# Altium project WiFi智能家居.PrjPCB
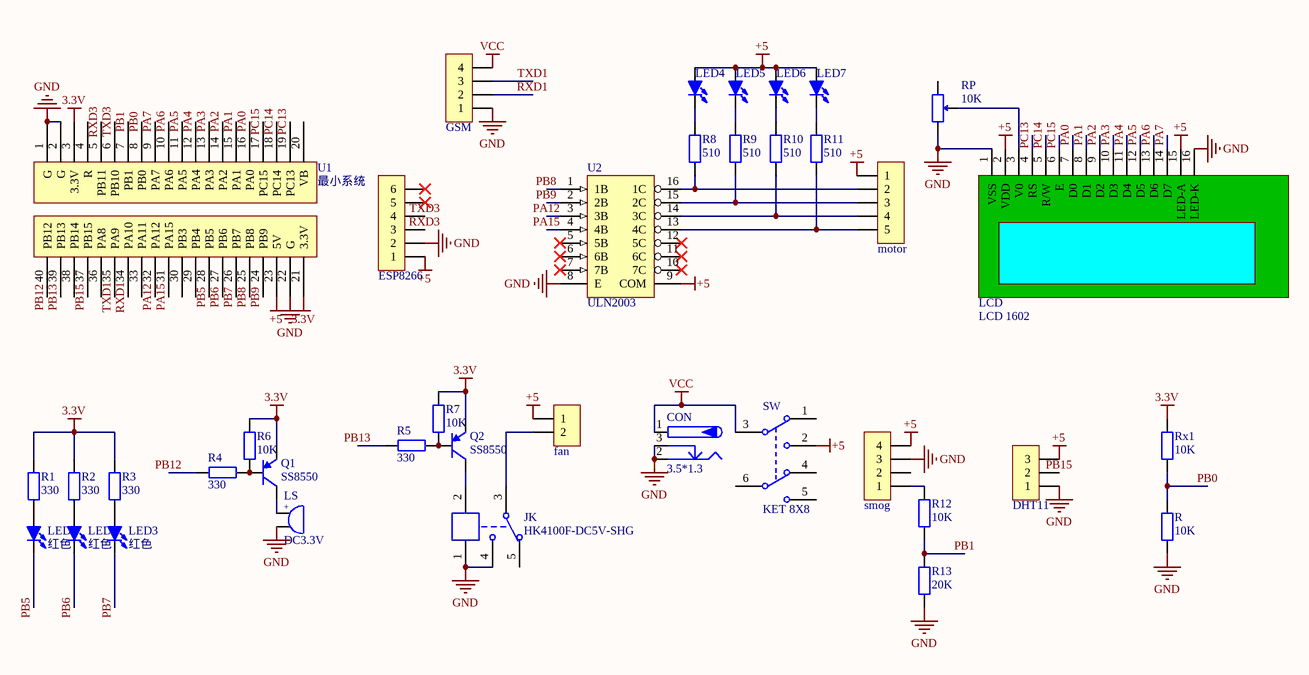
[diagram p0: 原理图.SchDoc]
1 sheet, 38 parts. Net scope: global (net labels, ports and power ports of the same name join across sheets).
Board file: PCB.PcbDoc

## Sheet 原理图.SchDoc
size A4

### Parts
CON  3.5*1.3  [DC-005]
DHT11  HDR-1X3  [HDR2.54-M-LI-3P]  (value not drawn)
ESP8266  HDR-1X6  [HDR2.54-M-LI-6P]  (value not drawn)
fan  HDR-1X2  [HDR2.54-LI-2P]  (value not drawn)
GSM  HDR-1X4  [HDR2.54-LI-4P]  (value not drawn)
JK  HK4100F-DC5V-SHG  [HK4100F]
LCD  LCD 1602  [LCD-1602]
LED1  红色  [LED 0805G]
LED2  红色  [LED 0805G]
LED3  红色  [LED 0805G]
LED4  (no value)  [LED 0805G]
LED5  (no value)  [LED 0805G]
LED6  (no value)  [LED 0805G]
LED7  (no value)  [LED 0805G]
LS  DC3.3V  [BEEP 5x9x5.5]
motor  HDR-1X5  [XH2.54-LI-5P]  (value not drawn)
Q1  SS8550  [SOT23-3M]
Q2  SS8550  [SOT23-3M]
R  10K  [RS 1/4W]
R1  330  [R 0805_M]
R2  330  [R 0805_M]
R3  330  [R 0805_M]
R4  330  [R 0805_M]
R5  330  [R 0805_M]
R6  10K  [R 0805_M]
R7  10K  [R 0805_M]
R8  510  [R 0805_M]
R9  510  [R 0805_M]
R10  510  [R 0805_M]
R11  510  [R 0805_M]
R12  10K  [RS 1/4W]
R13  20K  [RS 1/4W]
RP  10K  [RM065]
Rx1  10K  [RS 1/4W]
smog  HDR-1X4  [HDR2.54-M-LI-4P]  (value not drawn)
SW  KET 8X8  [KFT DIP-8X8]
U1  最小系统  [MINI]
U2  ULN2003  [DIP16-300]

### Nets
3.3V: Q1.2(E) Q2.2(E) R1.2 R2.2 R3.2 R6.2 R7.2 Rx1.2 U1.3(3.3V) U1.21(3.3V)
+5: DHT11.3 ESP8266.1 fan.1 LCD.2(VDD) LCD.15(LED-A) LED4.1(A) LED5.1(A) LED6.1(A) LED7.1(A) motor.1 smog.4 SW.2(COM2) U1.23(5V) U2.9(COM)
GND: CON.2 CON.3 DHT11.1 ESP8266.2 GSM.1 JK.1 JK.4 LCD.1(VSS) LCD.16(LED-K) LS.2 R.1 R13.1 RP.3 smog.3 U1.1(G) U1.2(G) U1.22(G) U2.8(E)
VCC: CON.1 GSM.4 SW.3(NO1)
PA0: LCD.7(D0) U1.16(PA0)
PA1: LCD.8(D1) U1.15(PA1)
PA2: LCD.9(D2) U1.14(PA2)
PA3: LCD.10(D3) U1.13(PA3)
PA4: LCD.11(D4) U1.12(PA4)
PA5: LCD.12(D5) U1.11(PA5)
PA6: LCD.13(D6) U1.10(PA6)
PA7: LCD.14(D7) U1.9(PA7)
PA12: U1.32(PA12) U2.3(3B)
PA15: U1.31(PA15) U2.4(4B)
PB0: R.2 Rx1.1 U1.8(PB0)
PB1: R12.1 R13.2 U1.7(PB1)
PB5: LED1.2(K) U1.28(PB5)
PB6: LED2.2(K) U1.27(PB6)
PB7: LED3.2(K) U1.26(PB7)
PB8: U1.25(PB8) U2.1(1B)
PB9: U1.24(PB9) U2.2(2B)
PB12: R4.1 U1.40(PB12)
PB13: R5.1 U1.39(PB13)
PB15: DHT11.2 U1.37(PB15)
PC13: LCD.4(RS) U1.19(PC13)
PC14: LCD.5(R/W) U1.18(PC14)
PC15: LCD.6(E) U1.17(PC15)
RXD1: GSM.2 U1.34(PA10)
RXD3: ESP8266.3 U1.5(PB11)
TXD1: GSM.3 U1.35(PA9)
TXD3: ESP8266.4 U1.6(PB10)
Netfan_2: fan.2 JK.3
NetJK_2: JK.2 Q2.3(C)
NetLCD_3: LCD.3(V0) RP.2
NetLED1_1: LED1.1(A) R1.1
NetLED2_1: LED2.1(A) R2.1
NetLED3_1: LED3.1(A) R3.1
NetLED4_2: LED4.2(K) R8.2
NetLED5_2: LED5.2(K) R9.2
NetLED6_2: LED6.2(K) R10.2
NetLED7_2: LED7.2(K) R11.2
NetLS_1: LS.1 Q1.3(C)
Netmotor_2: motor.2 R8.1 U2.16(1C)
Netmotor_3: motor.3 R9.1 U2.15(2C)
Netmotor_4: motor.4 R10.1 U2.14(3C)
Netmotor_5: motor.5 R11.1 U2.13(4C)
NetQ1_1: Q1.1(B) R4.2 R6.1
NetQ2_1: Q2.1(B) R5.2 R7.1
NetR12_2: R12.2 smog.1

Not connected (* = marked no-connect by the designer): ESP8266 5* 6*; JK 5; RP 1; smog 2; SW 1(NC1) 4(NO2) 5(COM2) 6(NC2); U1 4(R) 20(VB) 29(PB4) 30(PB3) 33(PA11) 36(PA8) 38(PB14); U2 5(5B)* 6(6B)* 7(7B)* 10(7C)* 11(6C)* 12(5C)*

### Notes on the sheet
- (in symbol BEEP) +

### Library data of the parts
CON = P-DC: 低压电源接口; BOM名称: DC电源接口; 版权归属: 源创客; 学习资源: www.ooocke.com
DHT11 = Header 3: 3P接插件; 版权归属: 源创客; BOM名称: 3P接插件; 学习资源: www.ooocke.com
ESP8266 = Header 6: 6P接插件; 版权归属: 源创客; BOM名称: 6P接插件; 学习资源: www.ooocke.com
fan = Header 2: 2P接插件; 版权归属: 源创客; BOM名称: 2P接插件; 学习资源: www.ooocke.com
GSM smog = Header 4: 4P接插件; 版权归属: 源创客; BOM名称: 4P接插件; 学习资源: www.ooocke.com
JK = HK4100F: 一组转换; BOM名称: 一组继电器; 版权归属: 源创客; 学习资源: www.ooocke.com
LCD = LCD 1602: 版权归属: 源创客; BOM名称: LCD 1602; 学习资源: www.ooocke.com
LED1-LED7 = LED-SMD: 贴片LED; 版权归属: 源创客; BOM名称: 贴片LED; 学习资源: www.ooocke.com
LS = BEEP: 蜂鸣器; 版权归属: 源创客; BOM名称: 蜂鸣器; 学习资源: www.ooocke.com
motor = Header 5: 5P接插件; 版权归属: 源创客; BOM名称: 5P接插件; 学习资源: www.ooocke.com
Q1 Q2 = 8550-SMD: 高频放大-PNP型; 版权归属: 源创客; 属性: 40V 1.5A 1W 100MHZ; BOM名称: 高频放大-PNP型; 学习资源: www.ooocke.com
R R12 R13 Rx1 = R-CRR: 直插色环电阻; BOM名称: 色环电阻; 版权归属: 源创客; 学习资源: www.ooocke.com
R1-R11 = R: 贴片电阻; 版权归属: 源创客; BOM名称: 贴片电阻; 学习资源: www.ooocke.com
RP = RP-ID: 插件单联电位器; BOM名称: 插件电位器; 版权归属: 源创客; 学习资源: www.ooocke.com
SW = KET 8X8: 8*8自锁开关; 版权归属: 源创客; BOM名称: 8*8自锁开关; 学习资源: www.ooocke.com
U1 = c8t6最小系统
U2 = ULN2003-2: 达林顿驱动芯片; 版权归属: 源创客; BOM名称: 达林顿驱动芯片; 学习资源: www.ooocke.com